# EAGLE schematic laserdriver (EAGLE 6.0)
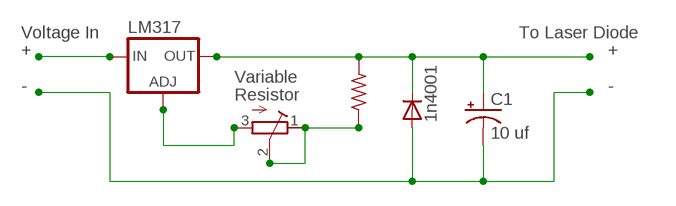
[diagram p0: schematic, sheet 1]

## Parts
C1  10 uf  CPOL-USE2-5  [E2-5]
D1  1N4004  [DO41-10]
IC1  LM317TL  [317TL]
R1  R-US_0204/7  [0204/7]
R2  R-TRIMM43P  [RTRIM43P]

## Nets
N$1: IC1.3(IN)
N$2: IC1.1(ADJ) R2.3(E)
N$3: R1.1 R2.1(A) R2.2(S)
N$4: C1.- D1.A
N$5: C1.+ D1.C IC1.2(OUT)
N$6: R1.2

## Notes on the sheet
- LM317
- Voltage In | To Laser Diode
- + | +
- Variable
- - | -
- Resistor
- 1n4001

## Library data of the parts
C1 = resistor:CPOL-US: POLARIZED CAPACITOR, American symbol
D1 = diode:1N4004: DIODE general purpose rectifier, 1 A
IC1 = v-reg:LM317TL: VOLTAGE REGULATOR
R1 = resistor:R-US_: RESISTOR, American symbol
R2 = resistor:R-TRIMM: Trimm resistor